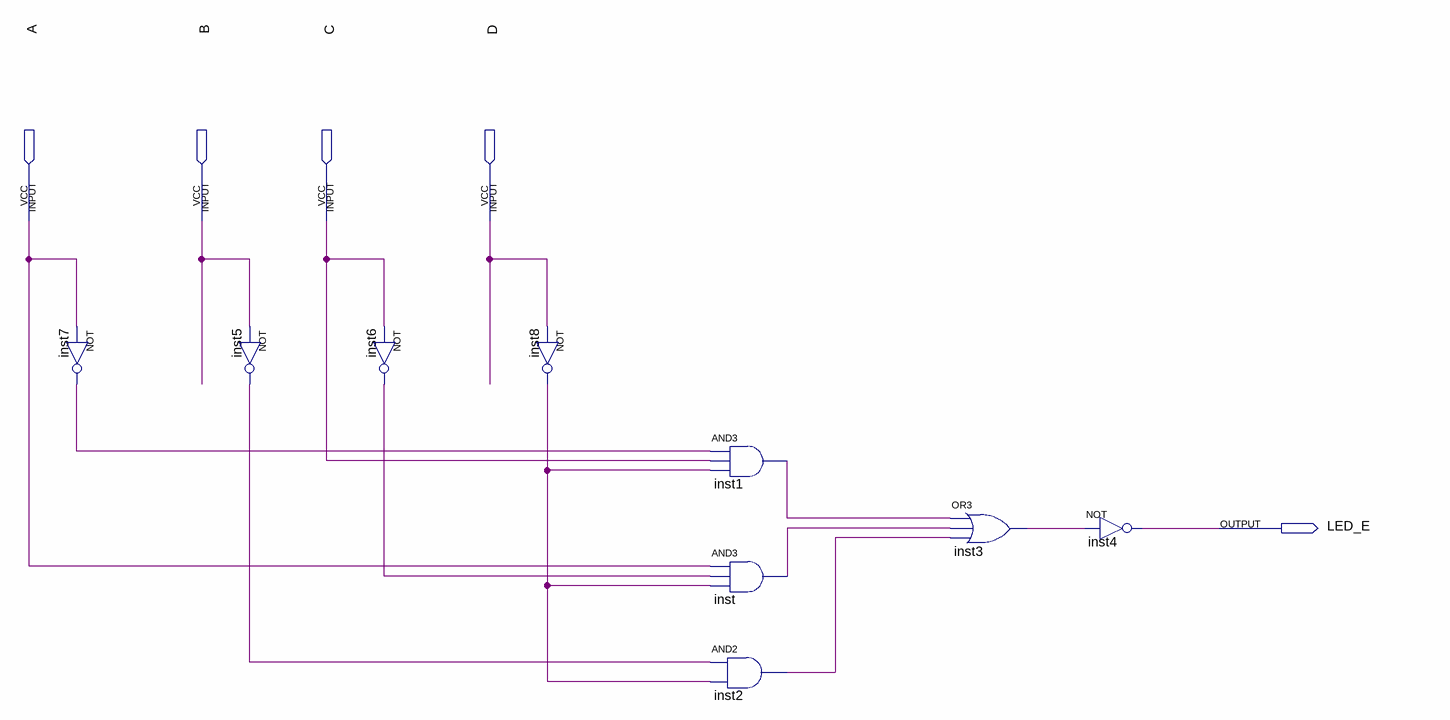
[diagram p0: schematic sheet]
// Quartus schematic led_e.bdf as structural Verilog: 9 symbols, 5 pins
module led_e (
  input  A,
  input  B,
  input  C,
  input  D,
  output LED_E
);

  wire inst1_out, inst2_out, inst3_out, inst5_out, inst6_out, inst7_out, inst8_out, inst_out;

  not inst7 (inst7_out, A);
  not inst5 (inst5_out, B);
  not inst6 (inst6_out, C);
  not inst8 (inst8_out, D);
  and inst1 (inst1_out, inst7_out, C, inst8_out);
  and inst (inst_out, A, inst6_out, inst8_out);
  and inst2 (inst2_out, inst5_out, inst8_out);
  or inst3 (inst3_out, inst1_out, inst_out, inst2_out);
  not inst4 (LED_E, inst3_out);
endmodule
